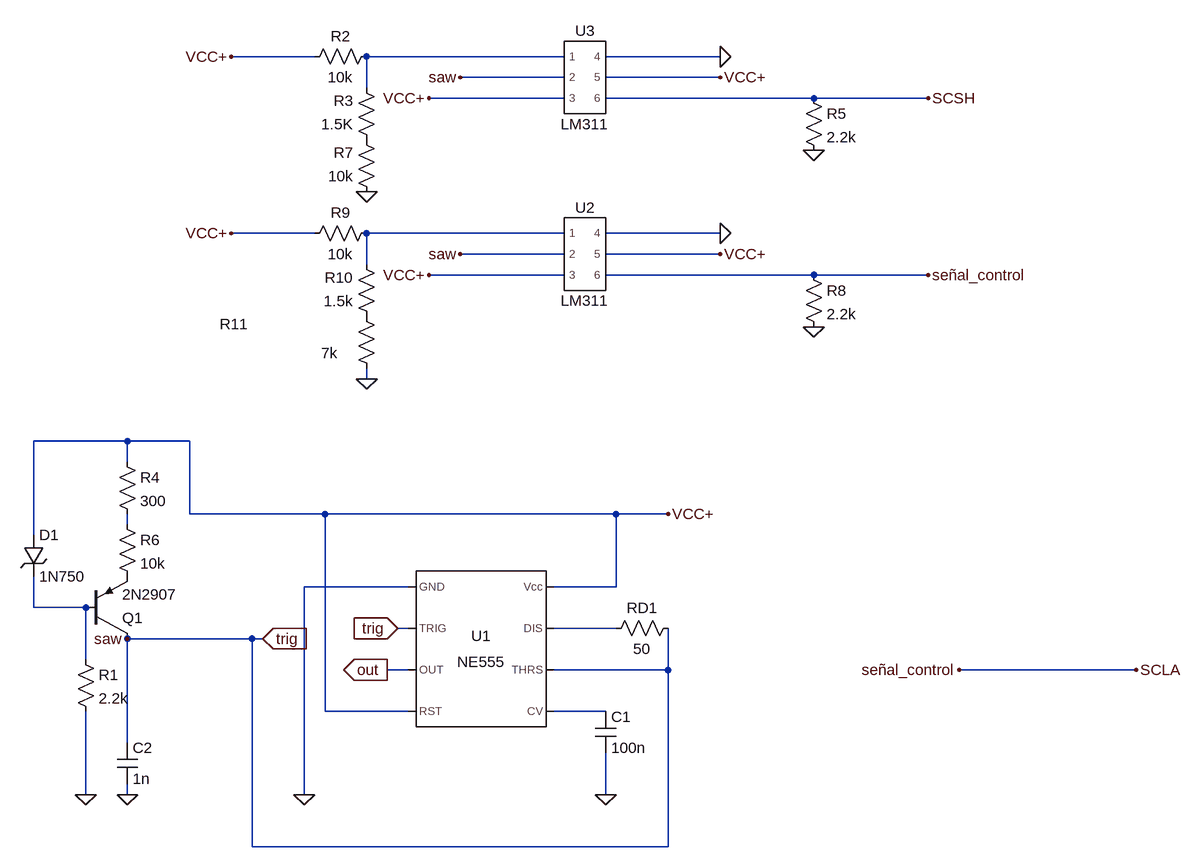
[diagram p0: schematic Oscilador2.asc]
Oscilador2.asc, the LTspice schematic file:
Version 4
SHEET 1 1052 916
WIRE -288 -304 -416 -304
WIRE 96 -304 -208 -304
WIRE 336 -304 160 -304
WIRE 96 -272 -64 -272
WIRE 336 -272 160 -272
WIRE -208 -256 -208 -304
WIRE 96 -240 -112 -240
WIRE 480 -240 160 -240
WIRE 656 -240 480 -240
WIRE -288 -32 -416 -32
WIRE 96 -32 -208 -32
WIRE 336 -32 160 -32
WIRE 96 0 -64 0
WIRE 336 0 160 0
WIRE -208 16 -208 -32
WIRE 96 32 -112 32
WIRE 480 32 160 32
WIRE 656 32 480 32
WIRE -208 192 -208 176
WIRE -576 288 -720 288
WIRE -480 288 -576 288
WIRE -576 320 -576 288
WIRE -480 400 -480 288
WIRE -272 400 -480 400
WIRE 176 400 -272 400
WIRE 256 400 176 400
WIRE -576 416 -576 400
WIRE -720 432 -720 288
WIRE -144 512 -304 512
WIRE 176 512 176 400
WIRE 176 512 80 512
WIRE -720 544 -720 496
WIRE -640 544 -720 544
WIRE -144 576 -160 576
WIRE 176 576 80 576
WIRE -384 592 -576 592
WIRE -368 592 -384 592
WIRE -640 624 -640 544
WIRE -144 640 -176 640
WIRE 256 640 256 576
WIRE 256 640 80 640
WIRE 976 640 704 640
WIRE -272 704 -272 400
WIRE -144 704 -272 704
WIRE 160 704 80 704
WIRE -576 752 -576 592
WIRE -640 832 -640 704
WIRE -576 832 -576 816
WIRE -304 832 -304 512
WIRE 160 832 160 768
WIRE -384 912 -384 592
WIRE 256 912 256 640
WIRE 256 912 -384 912
FLAG 704 640 señal_control
FLAG 976 640 SCLA
FLAG -304 832 0
FLAG 160 832 0
FLAG -176 640 out
IOPIN -176 640 Out
FLAG -160 576 trig
IOPIN -160 576 In
FLAG -576 832 0
FLAG -640 832 0
FLAG -368 592 trig
IOPIN -368 592 In
FLAG -576 592 saw
FLAG -208 -96 0
FLAG 336 -304 0
FLAG -64 -272 saw
FLAG 480 -160 0
FLAG 656 -240 SCSH
FLAG 336 -32 0
FLAG -64 0 saw
FLAG 480 112 0
FLAG 656 32 señal_control
FLAG -208 192 0
FLAG -416 -32 VCC+
FLAG -416 -304 VCC+
FLAG -112 32 VCC+
FLAG 336 0 VCC+
FLAG -112 -240 VCC+
FLAG 336 -272 VCC+
FLAG 256 400 VCC+
SYMBOL Misc\\NE555 -32 608 R0
SYMATTR InstName U1
SYMBOL cap 144 704 R0
SYMATTR InstName C1
SYMATTR Value 100n
SYMBOL pnp -640 592 M180
SYMATTR InstName Q1
SYMATTR Value 2N2907
SYMBOL res -656 608 R0
SYMATTR InstName R1
SYMATTR Value 2.2k
SYMATTR SpiceLine tol=1 pwr=0.1
SYMBOL cap -592 752 R0
SYMATTR InstName C2
SYMATTR Value 1n
SYMBOL res -192 -320 R90
WINDOW 0 0 56 VBottom 2
WINDOW 3 32 56 VTop 2
SYMATTR InstName R2
SYMATTR Value 10k
SYMBOL res -192 -160 R180
WINDOW 0 36 76 Left 2
WINDOW 3 36 40 Left 2
SYMATTR InstName R3
SYMATTR Value 1.5K
SYMBOL res 272 560 R90
WINDOW 0 0 56 VBottom 2
WINDOW 3 32 56 VTop 2
SYMATTR InstName RD1
SYMATTR Value 50
SYMBOL zener -736 432 R0
SYMATTR InstName D1
SYMATTR Value 1N750
SYMBOL res -592 304 R0
SYMATTR InstName R4
SYMATTR Value 300
SYMBOL res 464 -256 R0
SYMATTR InstName R5
SYMATTR Value 2.2k
SYMATTR SpiceLine tol=1 pwr=0.1
SYMBOL res -592 400 R0
SYMATTR InstName R6
SYMATTR Value 10k
SYMBOL res -192 -80 R180
WINDOW 0 36 76 Left 2
WINDOW 3 36 40 Left 2
SYMATTR InstName R7
SYMATTR Value 10k
SYMBOL res 464 16 R0
SYMATTR InstName R8
SYMATTR Value 2.2k
SYMATTR SpiceLine tol=1 pwr=0.1
SYMBOL res -192 -48 R90
WINDOW 0 0 56 VBottom 2
WINDOW 3 32 56 VTop 2
SYMATTR InstName R9
SYMATTR Value 10k
SYMBOL res -192 112 R180
WINDOW 0 36 76 Left 2
WINDOW 3 36 40 Left 2
SYMATTR InstName R10
SYMATTR Value 1.5k
SYMBOL res -224 80 R0
WINDOW 0 -210 28 Left 2
WINDOW 3 -54 72 Left 2
SYMATTR InstName R11
SYMATTR Value 7k
SYMBOL LM311 128 0 R0
SYMATTR InstName U2
SYMBOL LM311 128 -272 R0
SYMATTR InstName U3

The netlist it stands for:
* Oscilador2.asc
XU1 0 saw out VCC+ N006 saw N005 VCC+ NE555  ; pins GND TRIG OUT RST CV THRS DIS Vcc
C1 N006 0 100n
Q1 saw N004 P001 0 2N2907
R1 N004 0 2.2k tol=1 pwr=0.1
C2 saw 0 1n
R2 N001 VCC+ 10k
R3 P002 N001 1.5K
RD1 saw N005 50
D1 VCC+ N004 1N750
R4 VCC+ N003 300
R5 SCSH 0 2.2k tol=1 pwr=0.1
R6 N003 P001 10k
R7 0 P002 10k
R8 SCLA 0 2.2k tol=1 pwr=0.1
R9 N002 VCC+ 10k
R10 P003 N002 1.5k
R11 P003 0 7k
XU2 N002 saw VCC+ 0 VCC+ SCLA LM311  ; pins 1 2 3 4 5 6
XU3 N001 saw VCC+ 0 VCC+ SCSH LM311  ; pins 1 2 3 4 5 6
.model D D
.lib standard.dio
.model NPN NPN
.model PNP PNP
.lib standard.bjt
.lib NE555.sub
.lib C:\Users\lisan\Documents\Repositorios\ASSD\TP1---Muestreo\Integracion LTSpice\LM311.txt
.backanno
.end